# Altium project Multiplexor.PrjPcb
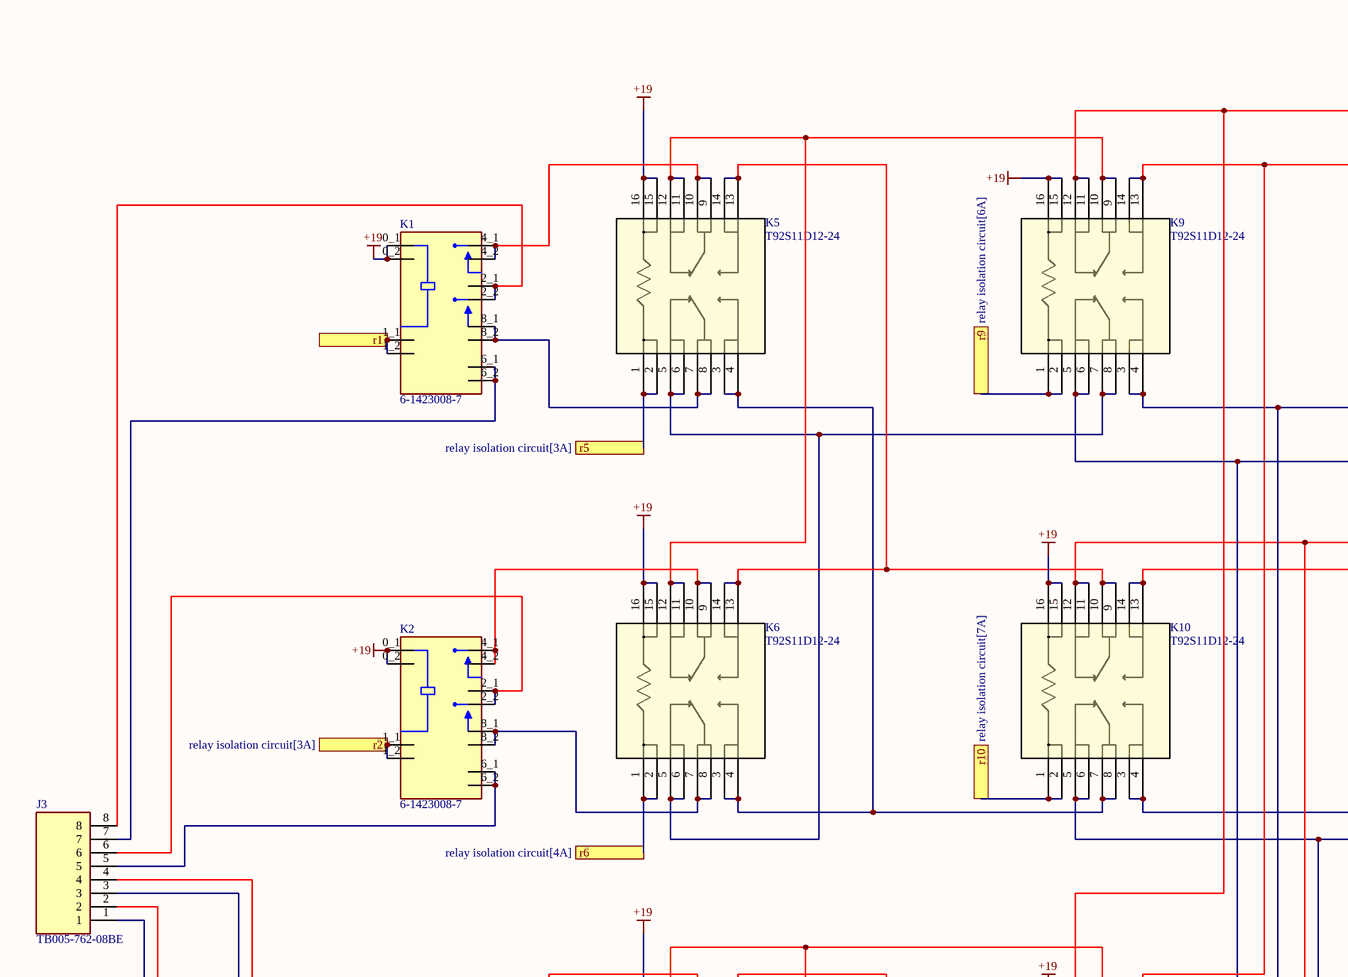
[diagram p0: multiplexor circuit.SchDoc, top left]
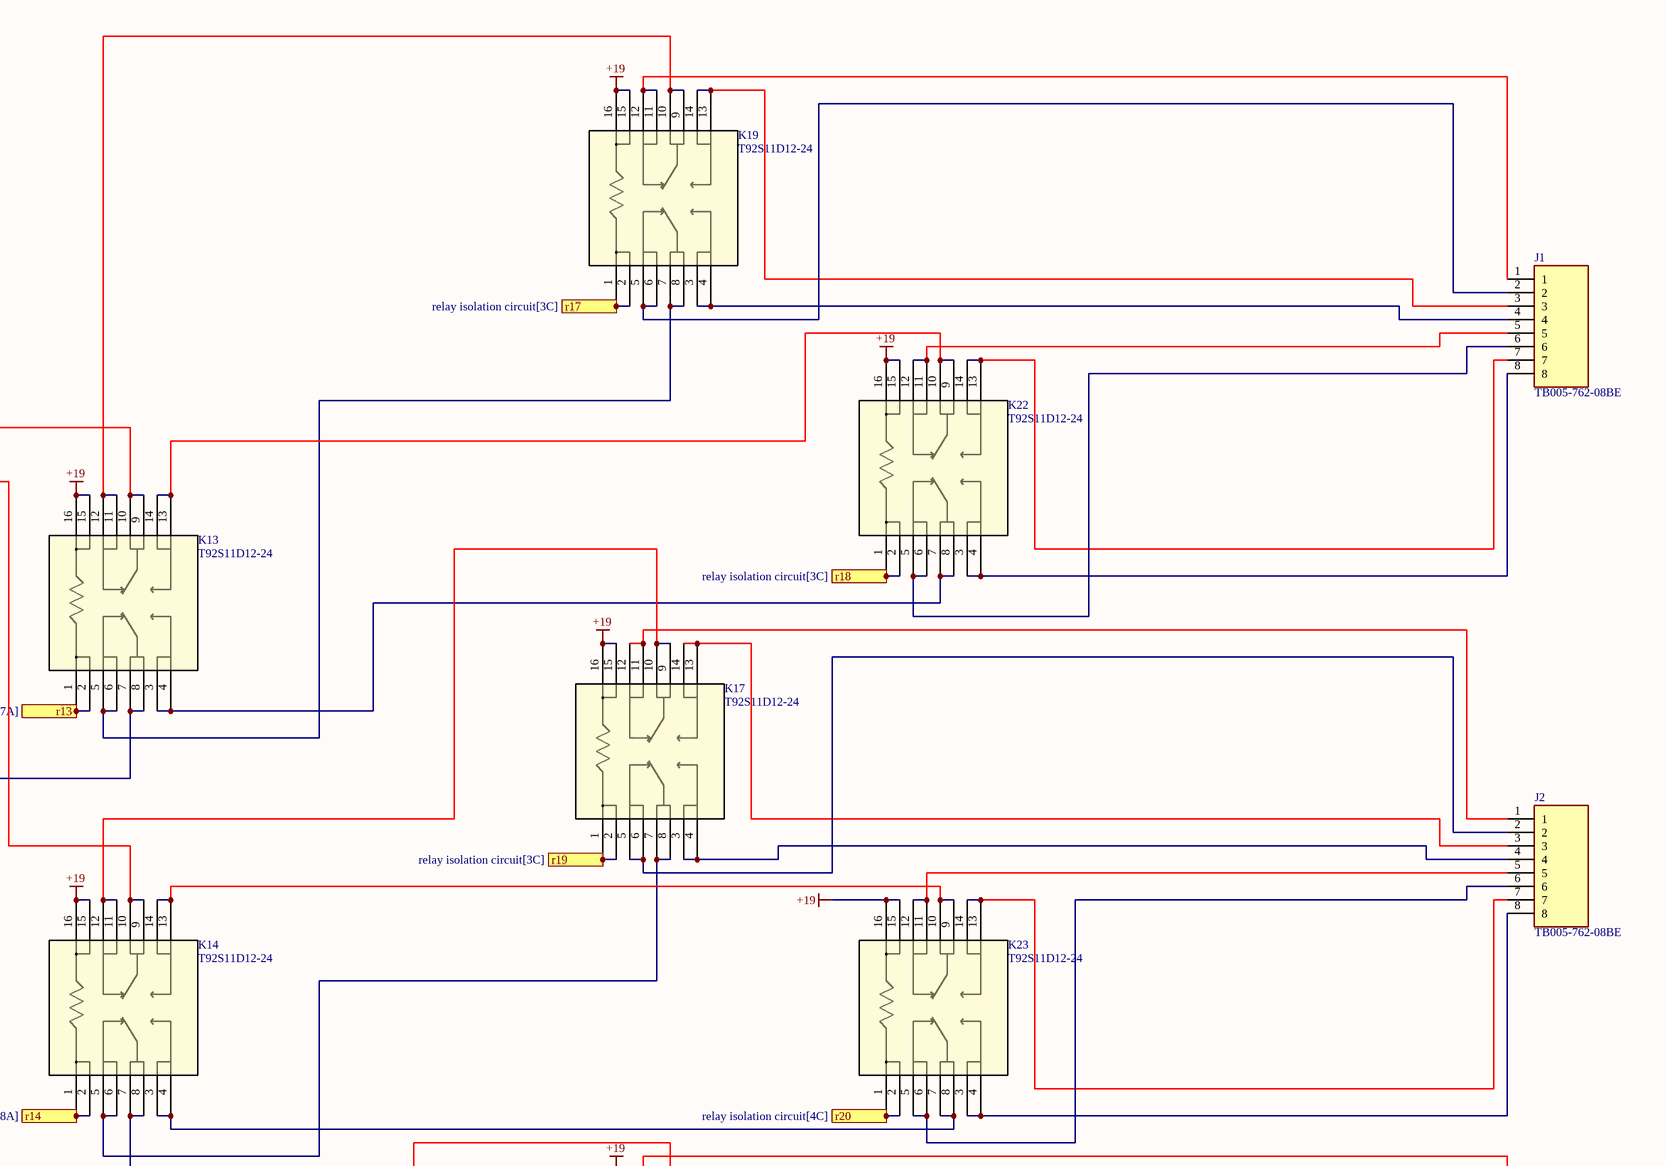
[diagram p1: multiplexor circuit.SchDoc, top right]
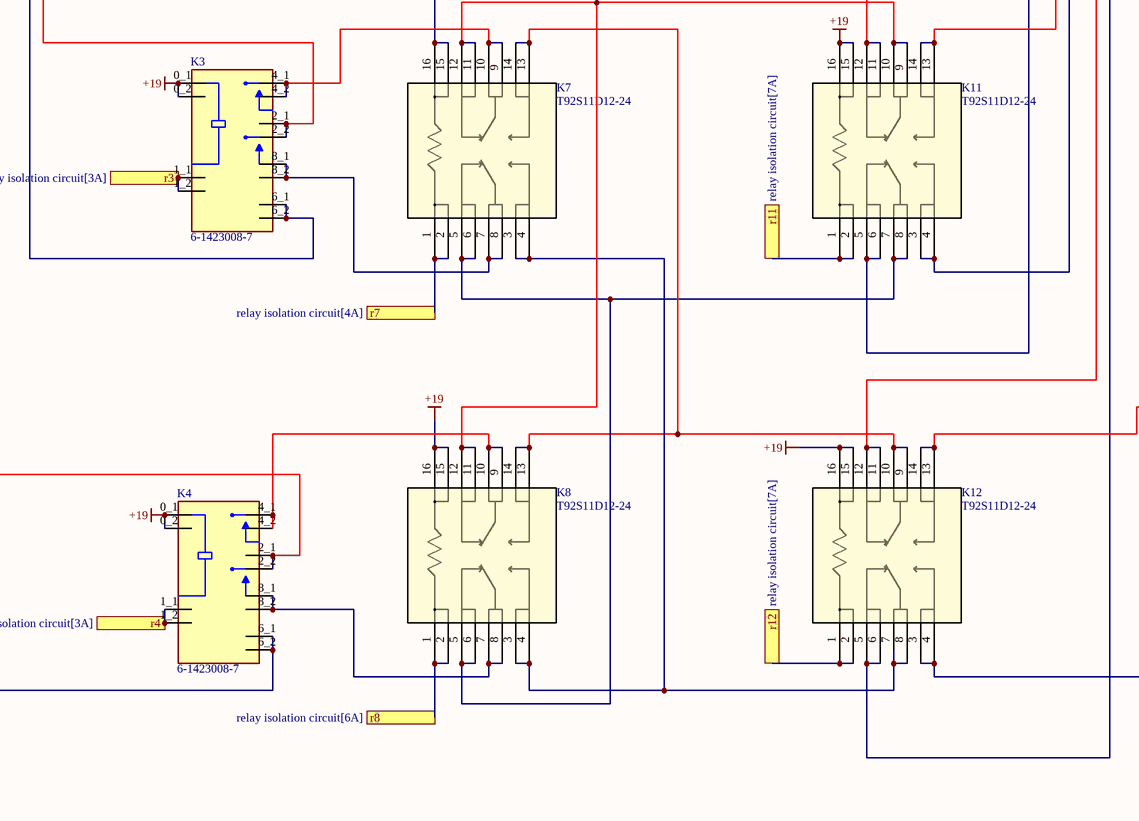
[diagram p2: multiplexor circuit.SchDoc, bottom left]
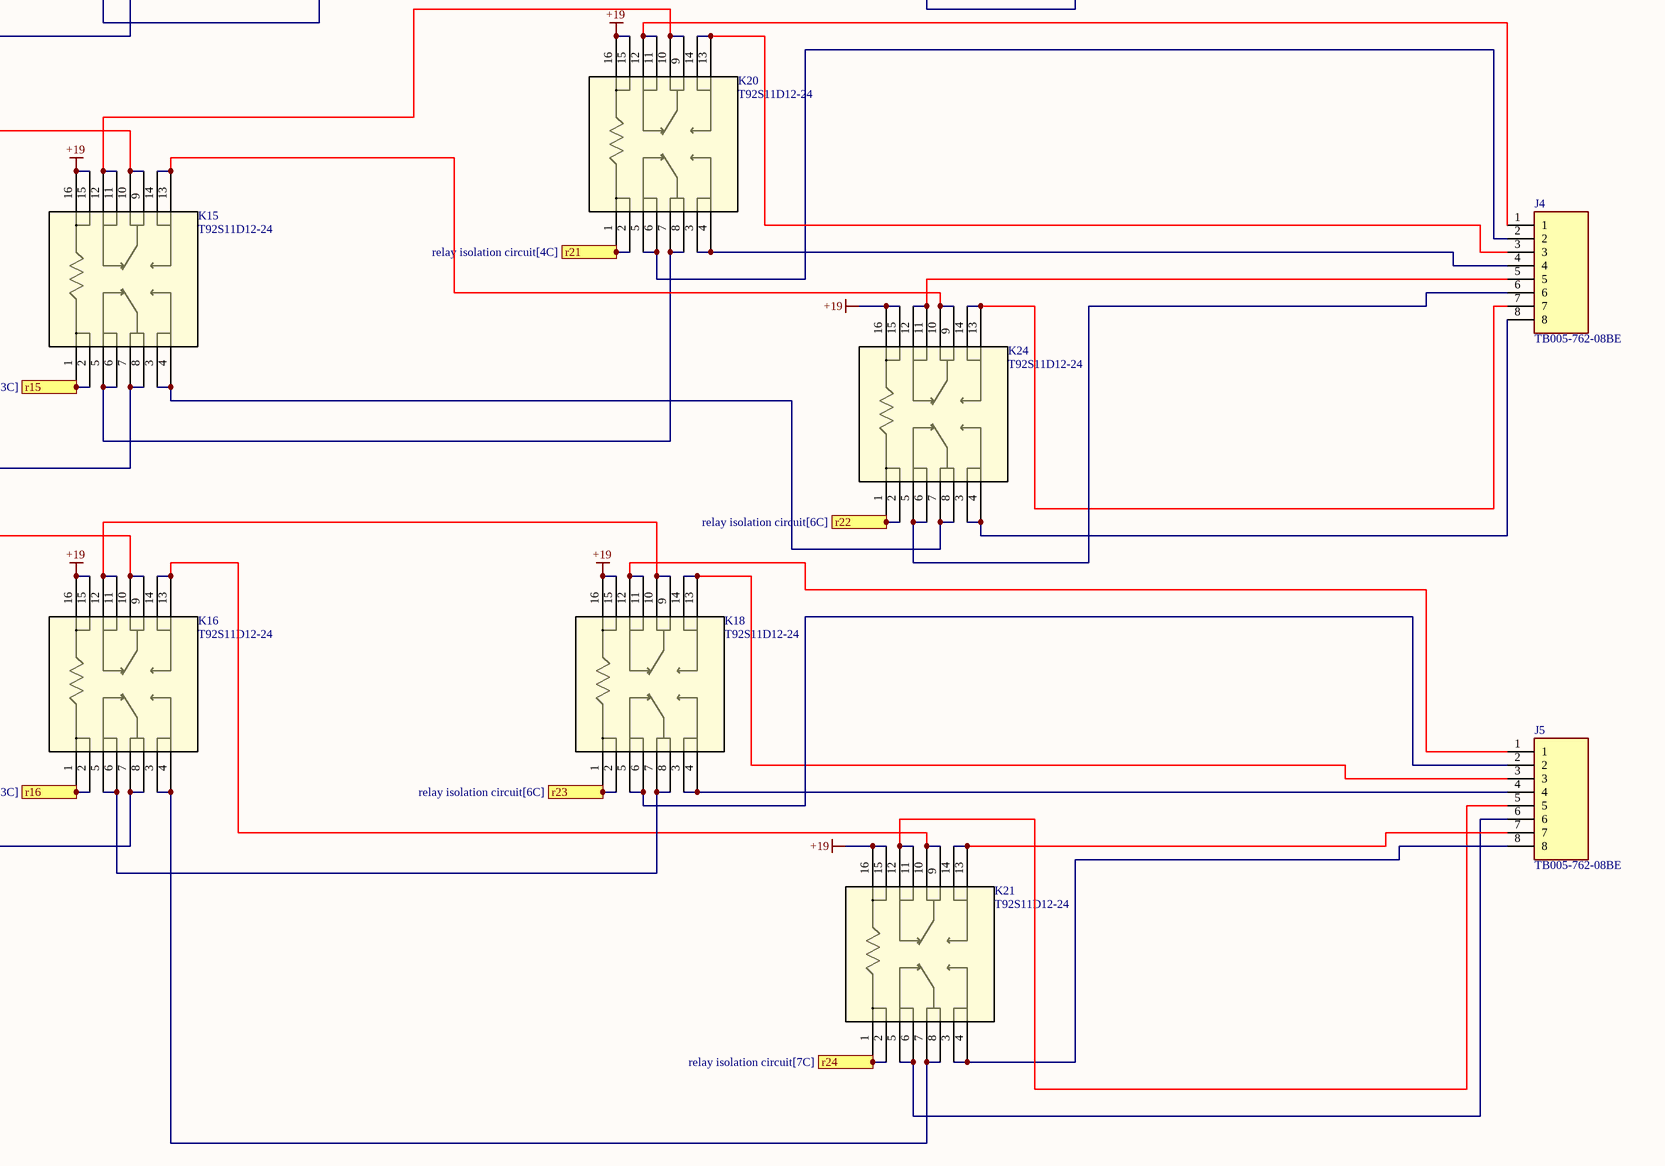
[diagram p3: multiplexor circuit.SchDoc, bottom right]
3 sheets, 181 parts. Net scope: flat (ports and power ports of the same name join across sheets).
Board file: multiplexor.PcbDoc
Sheets:
  multiplexor circuit.SchDoc
  relay isolation circuit.SchDoc
  Relay I2C to GPIO.SchDoc

## Sheet multiplexor circuit.SchDoc
size D; SheetNumber: 1; SheetTotal: 3

### Parts
J1  TB005-762-08BE  [CUI_TB005-762-08BE]
J2  TB005-762-08BE  [CUI_TB005-762-08BE]
J3  TB005-762-08BE  [CUI_TB005-762-08BE]
J4  TB005-762-08BE  [CUI_TB005-762-08BE]
J5  TB005-762-08BE  [CUI_TB005-762-08BE]
K1  6-1423008-7  [RELAY_6-1423008-7]
K2  6-1423008-7  [RELAY_6-1423008-7]
K3  6-1423008-7  [RELAY_6-1423008-7]
K4  6-1423008-7  [RELAY_6-1423008-7]
K5  T92S11D12-24  [T92S11D12-24_TEC-corrected]
K6  T92S11D12-24  [T92S11D12-24_TEC-corrected]
K7  T92S11D12-24  [T92S11D12-24_TEC-corrected]
K8  T92S11D12-24  [T92S11D12-24_TEC-corrected]
K9  T92S11D12-24  [T92S11D12-24_TEC-corrected]
K10  T92S11D12-24  [T92S11D12-24_TEC-corrected]
K11  T92S11D12-24  [T92S11D12-24_TEC-corrected]
K12  T92S11D12-24  [T92S11D12-24_TEC-corrected]
K13  T92S11D12-24  [T92S11D12-24_TEC-corrected]
K14  T92S11D12-24  [T92S11D12-24_TEC-corrected]
K15  T92S11D12-24  [T92S11D12-24_TEC-corrected]
K16  T92S11D12-24  [T92S11D12-24_TEC-corrected]
K17  T92S11D12-24  [T92S11D12-24_TEC-corrected]
K18  T92S11D12-24  [T92S11D12-24_TEC-corrected]
K19  T92S11D12-24  [T92S11D12-24_TEC-corrected]
K20  T92S11D12-24  [T92S11D12-24_TEC-corrected]
K21  T92S11D12-24  [T92S11D12-24_TEC-corrected]
K22  T92S11D12-24  [T92S11D12-24_TEC-corrected]
K23  T92S11D12-24  [T92S11D12-24_TEC-corrected]
K24  T92S11D12-24  [T92S11D12-24_TEC-corrected]

### Ports
r1 (see relay isolation circuit[3A]), r2 (see relay isolation circuit[3A]), r3 (see relay isolation circuit[3A]), r4 (see relay isolation circuit[3A]), r5 (see relay isolation circuit[3A]), r6 (see relay isolation circuit[4A]), r7 (see relay isolation circuit[4A]), r8 (see relay isolation circuit[6A]), r9 (see relay isolation circuit[6A]), r10 (see relay isolation circuit[7A]), r11 (see relay isolation circuit[7A]), r12 (see relay isolation circuit[7A]), r13 (see relay isolation circuit[7A]), r14 (see relay isolation circuit[8A]), r15 (see relay isolation circuit[3C]), r16 (see relay isolation circuit[3C]), r17 (see relay isolation circuit[3C]), r18 (see relay isolation circuit[3C]), r19 (see relay isolation circuit[3C]), r20 (see relay isolation circuit[4C]), r21 (see relay isolation circuit[4C]), r22 (see relay isolation circuit[6C]), r23 (see relay isolation circuit[6C]), r24 (see relay isolation circuit[7C])

### Nets
+19: K1.0_1(COIL1) K1.0_2(COIL1) K2.0_1(COIL1) K2.0_2(COIL1) K3.0_1(COIL1) K3.0_2(COIL1) K4.0_1(COIL1) K4.0_2(COIL1) K5.15 K5.16 K6.15 K6.16 K7.15 K7.16 K8.15 K8.16 K9.15 K9.16 K10.15 K10.16 K11.15 K11.16 K12.15 K12.16 K13.15 K13.16 K14.15 K14.16 K15.15 K15.16 K16.15 K16.16 K17.15 K17.16 K18.15 K18.16 K19.15 K19.16 K20.15 K20.16 K21.15 K21.16 K22.15 K22.16 K23.15 K23.16 K24.15 K24.16
NetCR1_2: K1.1_1(COIL2) K1.1_2(COIL2) ; port r1
NetCR2_2: K2.1_1(COIL2) K2.1_2(COIL2) ; port r2
NetCR3_2: K3.1_1(COIL2) K3.1_2(COIL2) ; port r3
NetCR4_2: K4.1_1(COIL2) K4.1_2(COIL2) ; port r4
NetCR5_2: K5.1 K5.2 ; port r5
NetCR6_2: K6.1 K6.2 ; port r6
NetCR7_2: K7.1 K7.2 ; port r7
NetCR8_2: K8.1 K8.2 ; port r8
NetCR9_2: K9.1 K9.2 ; port r9
NetCR10_2: K10.1 K10.2 ; port r10
NetCR11_2: K11.1 K11.2 ; port r11
NetCR12_2: K12.1 K12.2 ; port r12
NetCR13_2: K13.1 K13.2 ; port r13
NetCR14_2: K14.1 K14.2 ; port r14
NetCR15_2: K15.1 K15.2 ; port r15
NetCR16_2: K16.1 K16.2 ; port r16
NetCR17_2: K19.1 K19.2 ; port r17
NetCR18_2: K22.1 K22.2 ; port r18
NetCR19_2: K17.1 K17.2 ; port r19
NetCR20_2: K23.1 K23.2 ; port r20
NetCR21_2: K20.1 K20.2 ; port r21
NetCR22_2: K24.1 K24.2 ; port r22
NetCR23_2: K18.1 K18.2 ; port r23
NetCR24_2: K21.1 K21.2 ; port r24
NetJ1_1: J1.1 K19.11 K19.12
NetJ1_2: J1.2 K19.5 K19.6
NetJ1_3: J1.3 K19.13 K19.14
NetJ1_4: J1.4 K19.3 K19.4
NetJ1_5: J1.5 K22.11 K22.12
NetJ1_6: J1.6 K22.5 K22.6
NetJ1_7: J1.7 K22.13 K22.14
NetJ1_8: J1.8 K22.3 K22.4
NetJ2_1: J2.1 K17.11 K17.12
NetJ2_2: J2.2 K17.5 K17.6
NetJ2_3: J2.3 K17.13 K17.14
NetJ2_4: J2.4 K17.3 K17.4
NetJ2_5: J2.5 K23.11 K23.12
NetJ2_6: J2.6 K23.5 K23.6
NetJ2_7: J2.7 K23.13 K23.14
NetJ2_8: J2.8 K23.3 K23.4
NetJ3_1: J3.1 K4.6_1(NO2) K4.6_2(NO2)
NetJ3_2: J3.2 K4.2_1(NO1) K4.2_2(NO1)
NetJ3_3: J3.3 K3.6_1(NO2) K3.6_2(NO2)
NetJ3_4: J3.4 K3.2_1(NO1) K3.2_2(NO1)
NetJ3_5: J3.5 K2.6_1(NO2) K2.6_2(NO2)
NetJ3_6: J3.6 K2.2_1(NO1) K2.2_2(NO1)
NetJ3_7: J3.7 K1.6_1(NO2) K1.6_2(NO2)
NetJ3_8: J3.8 K1.2_1(NO1) K1.2_2(NO1)
NetJ4_1: J4.1 K20.11 K20.12
NetJ4_2: J4.2 K20.5 K20.6
NetJ4_3: J4.3 K20.13 K20.14
NetJ4_4: J4.4 K20.3 K20.4
NetJ4_5: J4.5 K24.11 K24.12
NetJ4_6: J4.6 K24.5 K24.6
NetJ4_7: J4.7 K24.13 K24.14
NetJ4_8: J4.8 K24.3 K24.4
NetJ5_1: J5.1 K18.11 K18.12
NetJ5_2: J5.2 K18.5 K18.6
NetJ5_3: J5.3 K18.13 K18.14
NetJ5_4: J5.4 K18.3 K18.4
NetJ5_5: J5.5 K21.11 K21.12
NetJ5_6: J5.6 K21.5 K21.6
NetJ5_7: J5.7 K21.13 K21.14
NetJ5_8: J5.8 K21.3 K21.4
NetK1_4_1: K1.4_1(COM1) K1.4_2(COM1) K5.9 K5.10
NetK1_8_1: K1.8_1(COM2) K1.8_2(COM2) K5.7 K5.8
NetK2_4_1: K2.4_1(COM1) K2.4_2(COM1) K6.9 K6.10
NetK2_8_1: K2.8_1(COM2) K2.8_2(COM2) K6.7 K6.8
NetK3_4_1: K3.4_1(COM1) K3.4_2(COM1) K7.9 K7.10
NetK3_8_1: K3.8_1(COM2) K3.8_2(COM2) K7.7 K7.8
NetK4_4_1: K4.4_1(COM1) K4.4_2(COM1) K8.9 K8.10
NetK4_8_1: K4.8_1(COM2) K4.8_2(COM2) K8.7 K8.8
NetK5_3: K5.3 K5.4 K6.3 K6.4 K10.7 K10.8
NetK5_5: K5.5 K5.6 K6.5 K6.6 K9.7 K9.8
NetK5_11: K5.11 K5.12 K6.11 K6.12 K9.9 K9.10
NetK5_13: K5.13 K5.14 K6.13 K6.14 K10.9 K10.10
NetK7_3: K7.3 K7.4 K8.3 K8.4 K12.7 K12.8
NetK7_5: K7.5 K7.6 K8.5 K8.6 K11.7 K11.8
NetK7_11: K7.11 K7.12 K8.11 K8.12 K11.9 K11.10
NetK7_13: K7.13 K7.14 K8.13 K8.14 K12.9 K12.10
NetK9_3: K9.3 K9.4 K11.3 K11.4 K14.7 K14.8
NetK9_5: K9.5 K9.6 K11.5 K11.6 K13.7 K13.8
NetK9_11: K9.11 K9.12 K11.11 K11.12 K13.9 K13.10
NetK9_13: K9.13 K9.14 K11.13 K11.14 K14.9 K14.10
NetK10_3: K10.3 K10.4 K12.3 K12.4 K16.7 K16.8
NetK10_5: K10.5 K10.6 K12.5 K12.6 K15.7 K15.8
NetK10_11: K10.11 K10.12 K12.11 K12.12 K15.9 K15.10
NetK10_13: K10.13 K10.14 K12.13 K12.14 K16.9 K16.10
NetK13_3: K13.3 K13.4 K22.7 K22.8
NetK13_5: K13.5 K13.6 K19.7 K19.8
NetK13_11: K13.11 K13.12 K19.9 K19.10
NetK13_13: K13.13 K13.14 K22.9 K22.10
NetK14_3: K14.3 K14.4 K23.7 K23.8
NetK14_5: K14.5 K14.6 K17.7 K17.8
NetK14_11: K14.11 K14.12 K17.9 K17.10
NetK14_13: K14.13 K14.14 K23.9 K23.10
NetK15_3: K15.3 K15.4 K24.7 K24.8
NetK15_5: K15.5 K15.6 K20.7 K20.8
NetK15_11: K15.11 K15.12 K20.9 K20.10
NetK15_13: K15.13 K15.14 K24.9 K24.10
NetK16_3: K16.3 K16.4 K21.7 K21.8
NetK16_5: K16.5 K16.6 K18.7 K18.8
NetK16_11: K16.11 K16.12 K18.9 K18.10
NetK16_13: K16.13 K16.14 K21.9 K21.10

### Library data of the parts
K1-K4 = 6-1423008-7: General Purpose Relay DPST-NO (2 Form A) 24VDC Coil Through Hole; MF: TE Connectivity / P&B; MP: 6-1423008-7; Package: None; Purchase-URL: https://pricing.snapeda.com/search/part/6-1423008-7/?ref=eda; Price: None; Value: *; SnapEDA_Link: https://www.snapeda.com/parts/6-1423008-7/TE%20Connectivity/view-part/6301405/?ref=snap; Check_prices: https://www.snapeda.com/parts/6-1423008-7/TE%20Connectivity/view-part/6301405/?ref=eda; Availability: In Stock
K5-K24 = T92S11D12-24: No Description Available; Mfr_Name: TE Connectivity; Copyright: Copyright (C) 2022 Ultra Librarian. All rights reserved.; Manufacturer_Part_Number: T92S11D12-24; Digi-Key_Part_Number_1: PB352-ND; RefDes: RefDes; Type: DEV
J1-J5 = TB005-762-08BE: Package: None; Price: None; Value: *; MP: TB005-762-08BE; Availability: Unavailable

## Sheet relay isolation circuit.SchDoc
size D; SheetNumber: 2; SheetTotal: 3; SPICEModelCachePQJRNVQB: <root> / <DocumentId>PQJRNVQB</DocumentId> / </root>
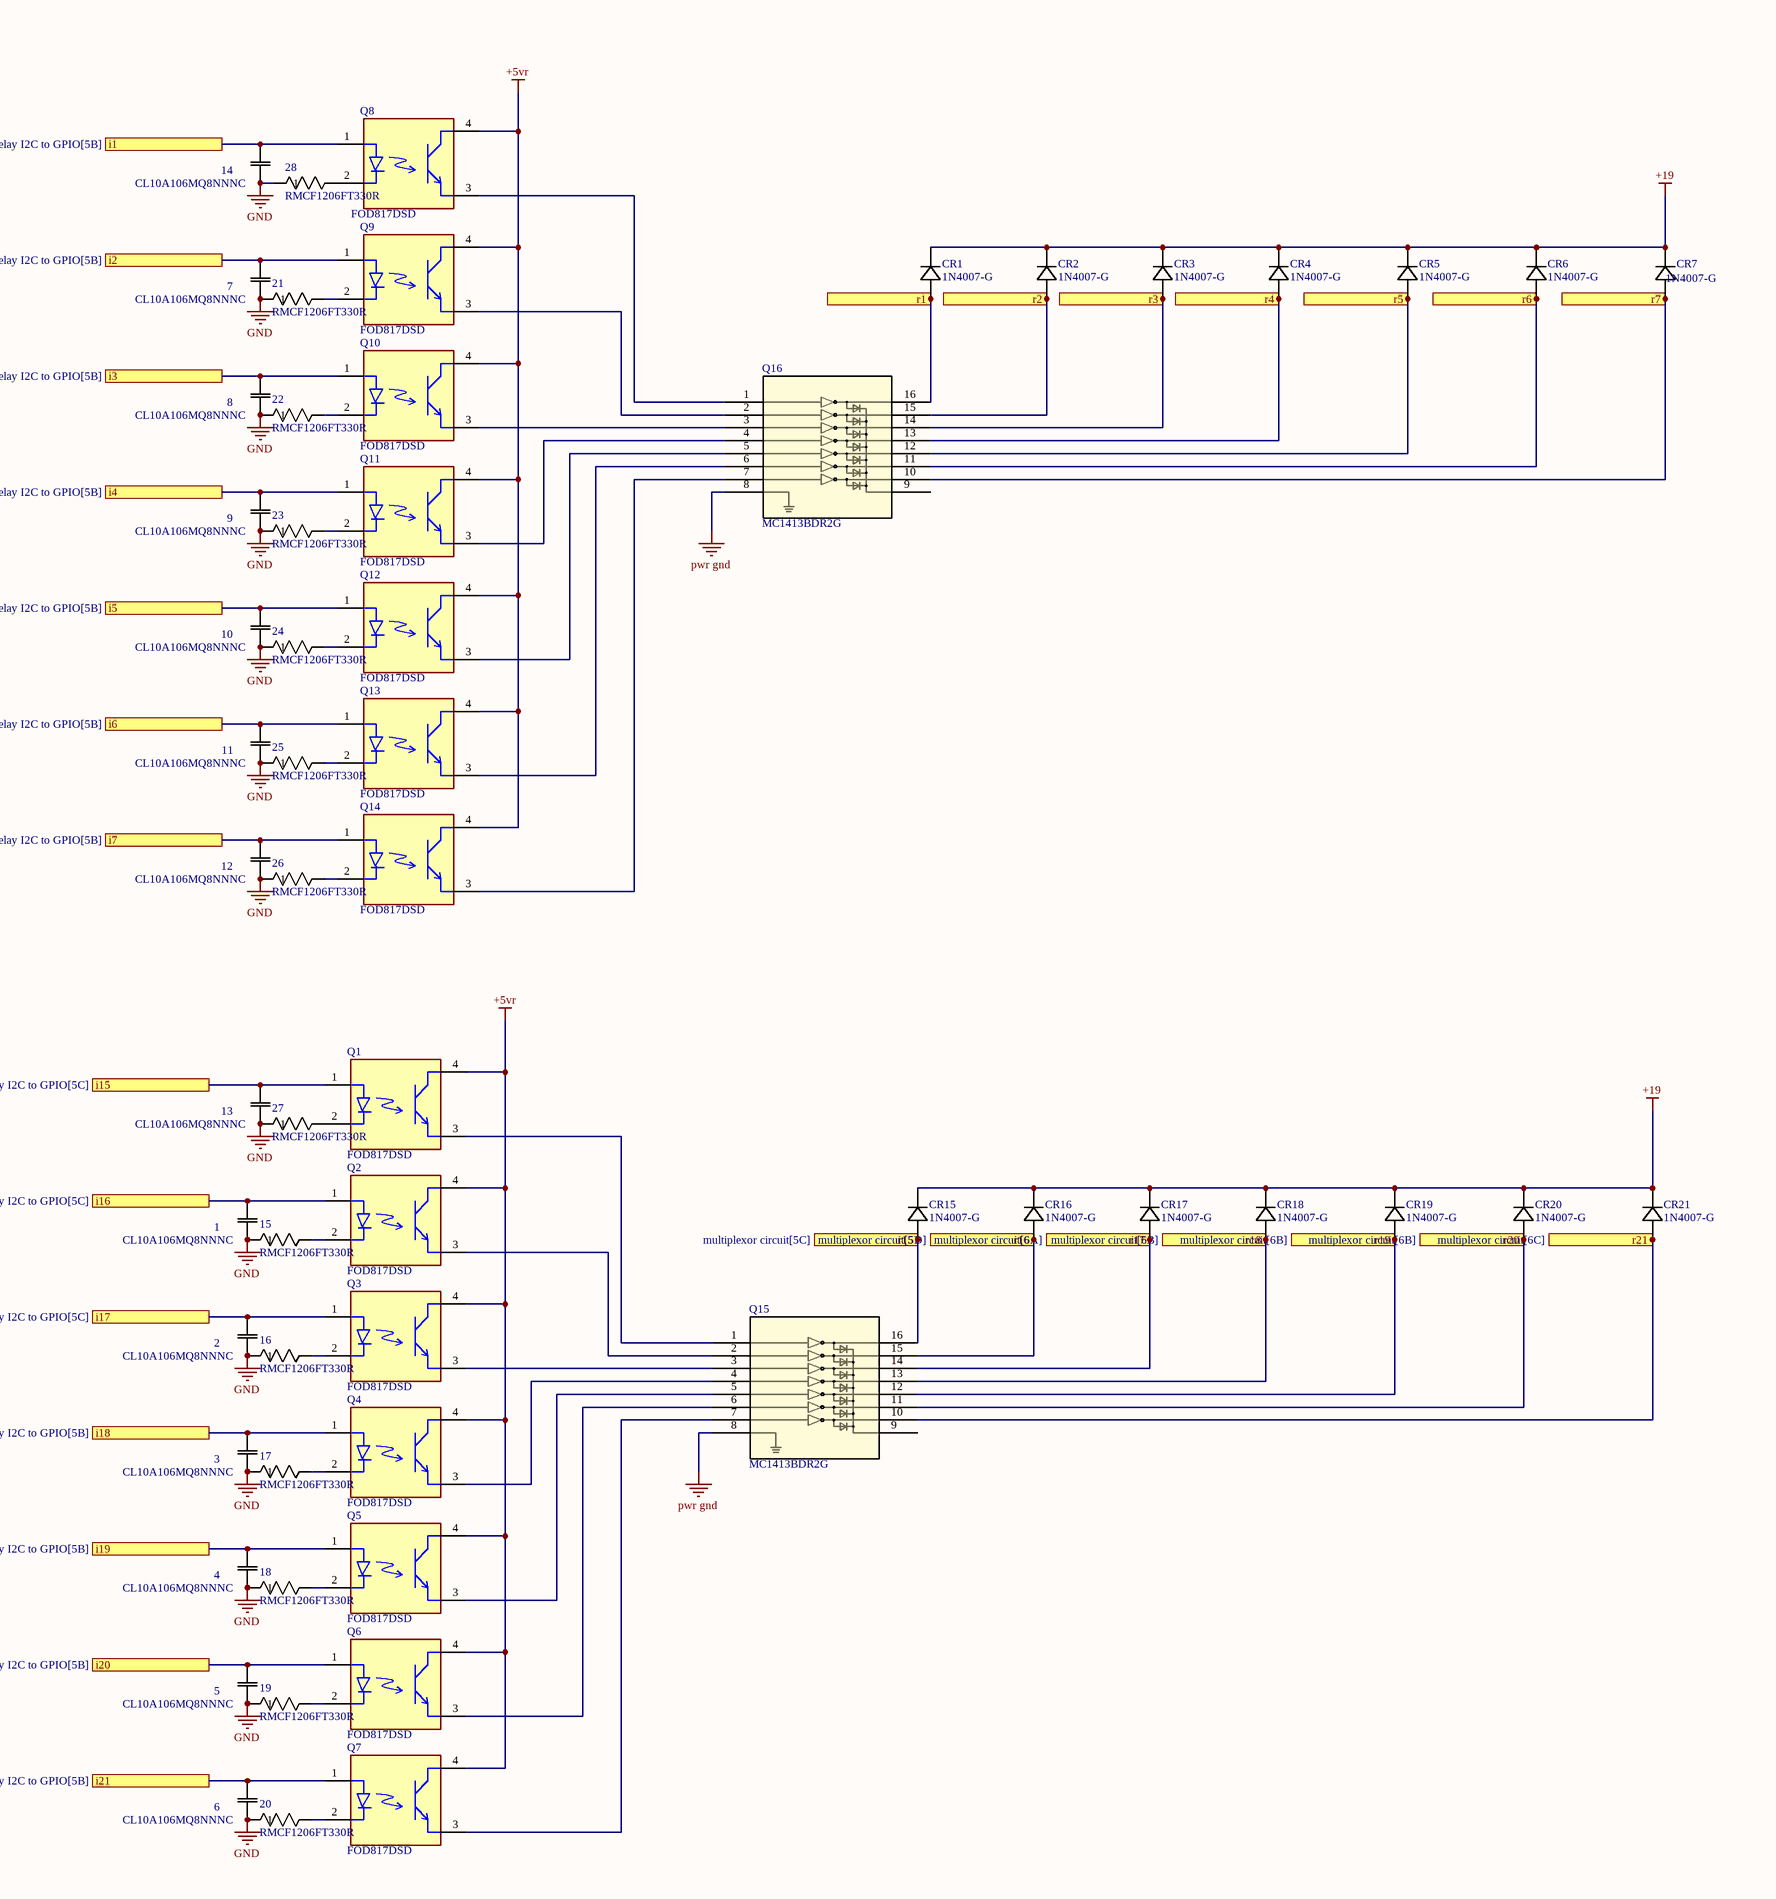
[diagram p4: relay isolation circuit.SchDoc, left]
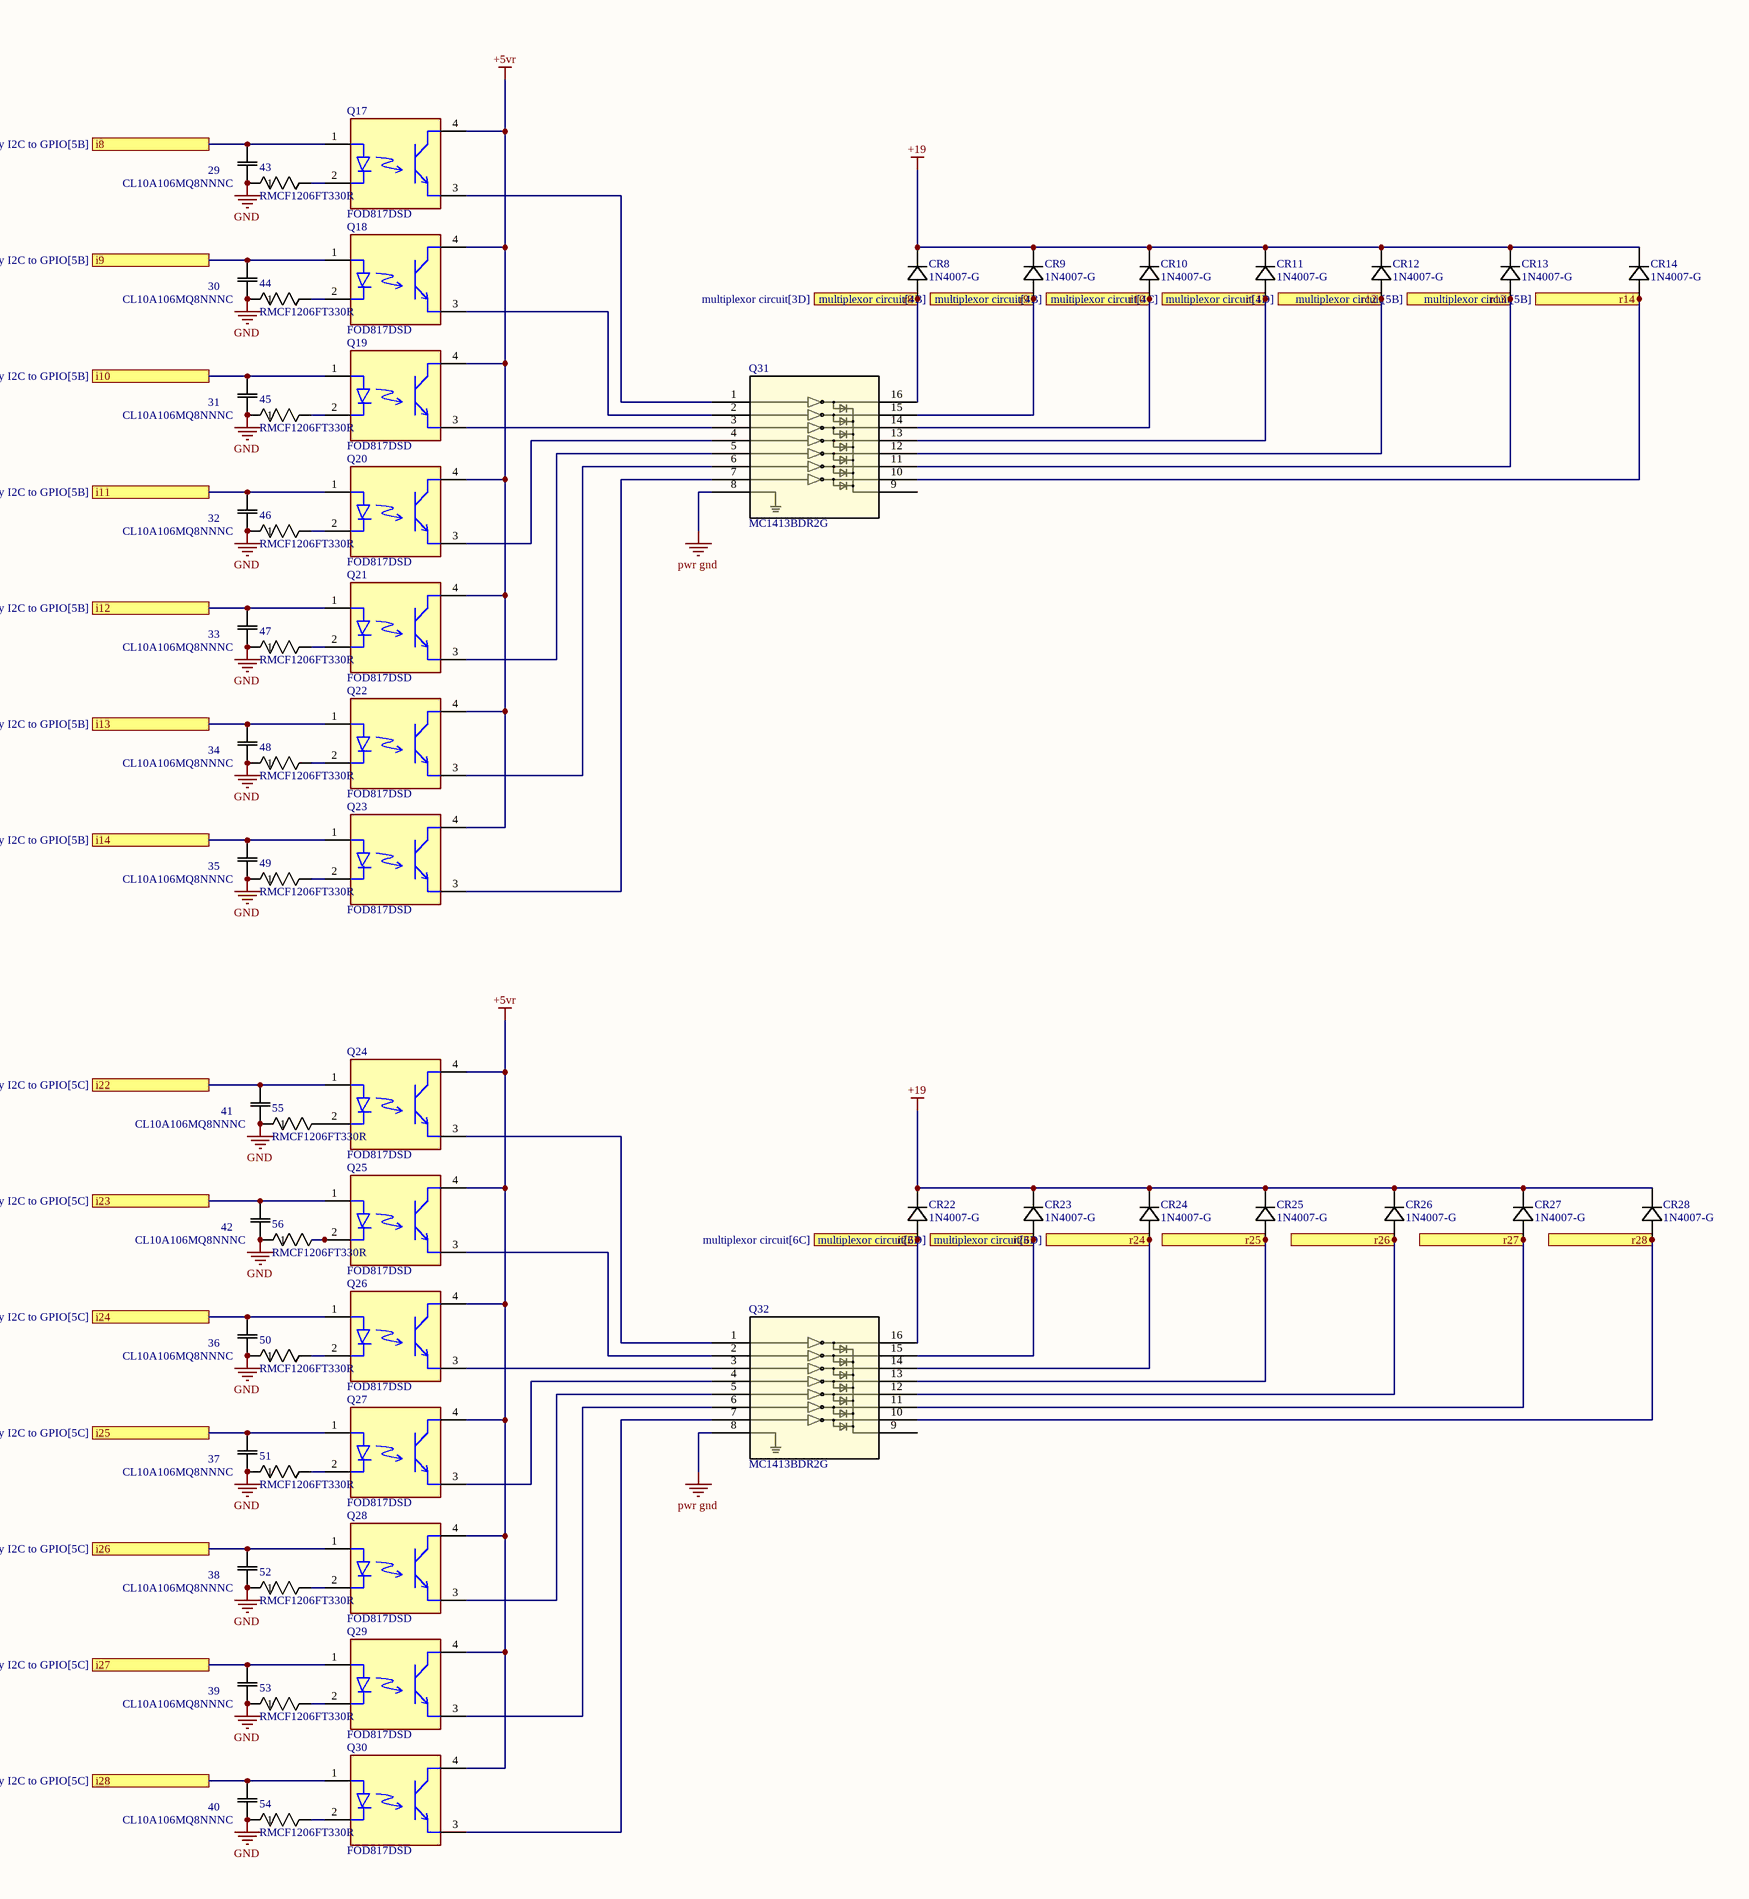
[diagram p5: relay isolation circuit.SchDoc, right]

### Parts
1  CL10A106MQ8NNNC  [CAP_CL10_SAM]
2  CL10A106MQ8NNNC  [CAP_CL10_SAM]
3  CL10A106MQ8NNNC  [CAP_CL10_SAM]
4  CL10A106MQ8NNNC  [CAP_CL10_SAM]
5  CL10A106MQ8NNNC  [CAP_CL10_SAM]
6  CL10A106MQ8NNNC  [CAP_CL10_SAM]
7  CL10A106MQ8NNNC  [CAP_CL10_SAM]
8  CL10A106MQ8NNNC  [CAP_CL10_SAM]
9  CL10A106MQ8NNNC  [CAP_CL10_SAM]
10  CL10A106MQ8NNNC  [CAP_CL10_SAM]
11  CL10A106MQ8NNNC  [CAP_CL10_SAM]
12  CL10A106MQ8NNNC  [CAP_CL10_SAM]
13  CL10A106MQ8NNNC  [CAP_CL10_SAM]
14  CL10A106MQ8NNNC  [CAP_CL10_SAM]
15  RMCF1206FT330R  [STA_RMCF1206_STP]
16  RMCF1206FT330R  [STA_RMCF1206_STP]
17  RMCF1206FT330R  [STA_RMCF1206_STP]
18  RMCF1206FT330R  [STA_RMCF1206_STP]
19  RMCF1206FT330R  [STA_RMCF1206_STP]
20  RMCF1206FT330R  [STA_RMCF1206_STP]
21  RMCF1206FT330R  [STA_RMCF1206_STP]
22  RMCF1206FT330R  [STA_RMCF1206_STP]
23  RMCF1206FT330R  [STA_RMCF1206_STP]
24  RMCF1206FT330R  [STA_RMCF1206_STP]
25  RMCF1206FT330R  [STA_RMCF1206_STP]
26  RMCF1206FT330R  [STA_RMCF1206_STP]
27  RMCF1206FT330R  [STA_RMCF1206_STP]
28  RMCF1206FT330R  [STA_RMCF1206_STP]
29  CL10A106MQ8NNNC  [CAP_CL10_SAM]
30  CL10A106MQ8NNNC  [CAP_CL10_SAM]
31  CL10A106MQ8NNNC  [CAP_CL10_SAM]
32  CL10A106MQ8NNNC  [CAP_CL10_SAM]
33  CL10A106MQ8NNNC  [CAP_CL10_SAM]
34  CL10A106MQ8NNNC  [CAP_CL10_SAM]
35  CL10A106MQ8NNNC  [CAP_CL10_SAM]
36  CL10A106MQ8NNNC  [CAP_CL10_SAM]
37  CL10A106MQ8NNNC  [CAP_CL10_SAM]
38  CL10A106MQ8NNNC  [CAP_CL10_SAM]
39  CL10A106MQ8NNNC  [CAP_CL10_SAM]
40  CL10A106MQ8NNNC  [CAP_CL10_SAM]
41  CL10A106MQ8NNNC  [CAP_CL10_SAM]
42  CL10A106MQ8NNNC  [CAP_CL10_SAM]
43  RMCF1206FT330R  [STA_RMCF1206_STP]
44  RMCF1206FT330R  [STA_RMCF1206_STP]
45  RMCF1206FT330R  [STA_RMCF1206_STP]
46  RMCF1206FT330R  [STA_RMCF1206_STP]
47  RMCF1206FT330R  [STA_RMCF1206_STP]
48  RMCF1206FT330R  [STA_RMCF1206_STP]
49  RMCF1206FT330R  [STA_RMCF1206_STP]
50  RMCF1206FT330R  [STA_RMCF1206_STP]
51  RMCF1206FT330R  [STA_RMCF1206_STP]
52  RMCF1206FT330R  [STA_RMCF1206_STP]
53  RMCF1206FT330R  [STA_RMCF1206_STP]
54  RMCF1206FT330R  [STA_RMCF1206_STP]
55  RMCF1206FT330R  [STA_RMCF1206_STP]
56  RMCF1206FT330R  [STA_RMCF1206_STP]
CR1  1N4007-G  [1N4-G]
CR2  1N4007-G  [1N4-G]
CR3  1N4007-G  [1N4-G]
CR4  1N4007-G  [1N4-G]
CR5  1N4007-G  [1N4-G]
CR6  1N4007-G  [1N4-G]
CR7  1N4007-G  [1N4-G]
CR8  1N4007-G  [1N4-G]
CR9  1N4007-G  [1N4-G]
CR10  1N4007-G  [1N4-G]
CR11  1N4007-G  [1N4-G]
CR12  1N4007-G  [1N4-G]
CR13  1N4007-G  [1N4-G]
CR14  1N4007-G  [1N4-G]
CR15  1N4007-G  [1N4-G]
CR16  1N4007-G  [1N4-G]
CR17  1N4007-G  [1N4-G]
CR18  1N4007-G  [1N4-G]
CR19  1N4007-G  [1N4-G]
CR20  1N4007-G  [1N4-G]
CR21  1N4007-G  [1N4-G]
CR22  1N4007-G  [1N4-G]
CR23  1N4007-G  [1N4-G]
CR24  1N4007-G  [1N4-G]
CR25  1N4007-G  [1N4-G]
CR26  1N4007-G  [1N4-G]
CR27  1N4007-G  [1N4-G]
CR28  1N4007-G  [1N4-G]
Q1  FOD817DSD  [FP-709AH-MFG]
Q2  FOD817DSD  [FP-709AH-MFG]
Q3  FOD817DSD  [FP-709AH-MFG]
Q4  FOD817DSD  [FP-709AH-MFG]
Q5  FOD817DSD  [FP-709AH-MFG]
Q6  FOD817DSD  [FP-709AH-MFG]
Q7  FOD817DSD  [FP-709AH-MFG]
Q8  FOD817DSD  [FP-709AH-MFG]
Q9  FOD817DSD  [FP-709AH-MFG]
Q10  FOD817DSD  [FP-709AH-MFG]
Q11  FOD817DSD  [FP-709AH-MFG]
Q12  FOD817DSD  [FP-709AH-MFG]
Q13  FOD817DSD  [FP-709AH-MFG]
Q14  FOD817DSD  [FP-709AH-MFG]
Q15  MC1413BDR2G  [SOIC16_751B-05_ONS]
Q16  MC1413BDR2G  [SOIC16_751B-05_ONS]
Q17  FOD817DSD  [FP-709AH-MFG]
Q18  FOD817DSD  [FP-709AH-MFG]
Q19  FOD817DSD  [FP-709AH-MFG]
Q20  FOD817DSD  [FP-709AH-MFG]
Q21  FOD817DSD  [FP-709AH-MFG]
Q22  FOD817DSD  [FP-709AH-MFG]
Q23  FOD817DSD  [FP-709AH-MFG]
Q24  FOD817DSD  [FP-709AH-MFG]
Q25  FOD817DSD  [FP-709AH-MFG]
Q26  FOD817DSD  [FP-709AH-MFG]
Q27  FOD817DSD  [FP-709AH-MFG]
Q28  FOD817DSD  [FP-709AH-MFG]
Q29  FOD817DSD  [FP-709AH-MFG]
Q30  FOD817DSD  [FP-709AH-MFG]
Q31  MC1413BDR2G  [SOIC16_751B-05_ONS]
Q32  MC1413BDR2G  [SOIC16_751B-05_ONS]

### Ports
i1 (see Relay I2C to GPIO[5B]), i2 (see Relay I2C to GPIO[5B]), i3 (see Relay I2C to GPIO[5B]), i4 (see Relay I2C to GPIO[5B]), i5 (see Relay I2C to GPIO[5B]), i6 (see Relay I2C to GPIO[5B]), i7 (see Relay I2C to GPIO[5B]), i8 (see Relay I2C to GPIO[5B]), i9 (see Relay I2C to GPIO[5B]), i10 (see Relay I2C to GPIO[5B]), i11 (see Relay I2C to GPIO[5B]), i12 (see Relay I2C to GPIO[5B]), i13 (see Relay I2C to GPIO[5B]), i14 (see Relay I2C to GPIO[5B]), i15 (see Relay I2C to GPIO[5C]), i16 (see Relay I2C to GPIO[5C]), i17 (see Relay I2C to GPIO[5C]), i18 (see Relay I2C to GPIO[5B]), i19 (see Relay I2C to GPIO[5B]), i20 (see Relay I2C to GPIO[5B]), i21 (see Relay I2C to GPIO[5B]), i22 (see Relay I2C to GPIO[5C]), i23 (see Relay I2C to GPIO[5C]), i24 (see Relay I2C to GPIO[5C]), i25 (see Relay I2C to GPIO[5C]), i26 (see Relay I2C to GPIO[5C]), i27 (see Relay I2C to GPIO[5C]), i28 (see Relay I2C to GPIO[5C]), r1 (see multiplexor circuit[3B]), r2 (see multiplexor circuit[3B]), r3 (see multiplexor circuit[3C]), r4 (see multiplexor circuit[3D]), r5 (see multiplexor circuit[3B]), r6 (see multiplexor circuit[3C]), r7 (see multiplexor circuit[3C]), r8 (see multiplexor circuit[3D]), r9 (see multiplexor circuit[4B]), r10 (see multiplexor circuit[4B]), r11 (see multiplexor circuit[4C]), r12 (see multiplexor circuit[4D]), r13 (see multiplexor circuit[5B]), r14 (see multiplexor circuit[5B]), r15 (see multiplexor circuit[5C]), r16 (see multiplexor circuit[5D]), r17 (see multiplexor circuit[6A]), r18 (see multiplexor circuit[6B]), r19 (see multiplexor circuit[6B]), r20 (see multiplexor circuit[6B]), r21 (see multiplexor circuit[6C]), r22 (see multiplexor circuit[6C]), r23 (see multiplexor circuit[6D]), r24 (see multiplexor circuit[6D]), r25, r26, r27, r28

### Nets
+5vr: Q1.4(C) Q2.4(C) Q3.4(C) Q4.4(C) Q5.4(C) Q6.4(C) Q7.4(C) Q8.4(C) Q9.4(C) Q10.4(C) Q11.4(C) Q12.4(C) Q13.4(C) Q14.4(C) Q17.4(C) Q18.4(C) Q19.4(C) Q20.4(C) Q21.4(C) Q22.4(C) Q23.4(C) Q24.4(C) Q25.4(C) Q26.4(C) Q27.4(C) Q28.4(C) Q29.4(C) Q30.4(C)
+19: CR1.1 CR2.1 CR3.1 CR4.1 CR5.1 CR6.1 CR7.1 CR8.1 CR9.1 CR10.1 CR11.1 CR12.1 CR13.1 CR14.1 CR15.1 CR16.1 CR17.1 CR18.1 CR19.1 CR20.1 CR21.1 CR22.1 CR23.1 CR24.1 CR25.1 CR26.1 CR27.1 CR28.1
GND: 1.1 2.1 3.1 4.1 5.1 6.1 7.1 8.1 9.1 10.1 11.1 12.1 13.1 14.1 15.1 16.1 17.1 18.1 19.1 20.1 21.1 22.1 23.1 24.1 25.1 26.1 27.1 28.1 29.1 30.1 31.1 32.1 33.1 34.1 35.1 36.1 37.1 38.1 39.1 40.1 41.1 42.1 43.1 44.1 45.1 46.1 47.1 48.1 49.1 50.1 51.1 52.1 53.1 54.1 55.1 56.1
pwr gnd: Q15.8 Q16.8 Q31.8 Q32.8
Net1_2: 1.2 Q2.1(A) ; port i16
Net2_2: 2.2 Q3.1(A) ; port i17
Net3_2: 3.2 Q4.1(A) ; port i18
Net4_2: 4.2 Q5.1(A) ; port i19
Net5_2: 5.2 Q6.1(A) ; port i20
Net6_2: 6.2 Q7.1(A) ; port i21
Net7_2: 7.2 Q9.1(A) ; port i2
Net8_2: 8.2 Q10.1(A) ; port i3
Net9_2: 9.2 Q11.1(A) ; port i4
Net10_2: 10.2 Q12.1(A) ; port i5
Net11_2: 11.2 Q13.1(A) ; port i6
Net12_2: 12.2 Q14.1(A) ; port i7
Net13_2: 13.2 Q1.1(A) ; port i15
Net14_2: 14.2 Q8.1(A) ; port i1
Net15_2: 15.2 Q2.2(C)
Net16_2: 16.2 Q3.2(C)
Net17_2: 17.2 Q4.2(C)
Net18_2: 18.2 Q5.2(C)
Net19_2: 19.2 Q6.2(C)
Net20_2: 20.2 Q7.2(C)
Net21_2: 21.2 Q9.2(C)
Net22_2: 22.2 Q10.2(C)
Net23_2: 23.2 Q11.2(C)
Net24_2: 24.2 Q12.2(C)
Net25_2: 25.2 Q13.2(C)
Net26_2: 26.2 Q14.2(C)
Net27_2: 27.2 Q1.2(C)
Net28_2: 28.2 Q8.2(C)
Net29_2: 29.2 Q17.1(A) ; port i8
Net30_2: 30.2 Q18.1(A) ; port i9
Net31_2: 31.2 Q19.1(A) ; port i10
Net32_2: 32.2 Q20.1(A) ; port i11
Net33_2: 33.2 Q21.1(A) ; port i12
Net34_2: 34.2 Q22.1(A) ; port i13
Net35_2: 35.2 Q23.1(A) ; port i14
Net36_2: 36.2 Q26.1(A) ; port i24
Net37_2: 37.2 Q27.1(A) ; port i25
Net38_2: 38.2 Q28.1(A) ; port i26
Net39_2: 39.2 Q29.1(A) ; port i27
Net40_2: 40.2 Q30.1(A) ; port i28
Net41_2: 41.2 Q24.1(A) ; port i22
Net42_2: 42.2 Q25.1(A) ; port i23
Net43_2: 43.2 Q17.2(C)
Net44_2: 44.2 Q18.2(C)
Net45_2: 45.2 Q19.2(C)
Net46_2: 46.2 Q20.2(C)
Net47_2: 47.2 Q21.2(C)
Net48_2: 48.2 Q22.2(C)
Net49_2: 49.2 Q23.2(C)
Net50_2: 50.2 Q26.2(C)
Net51_2: 51.2 Q27.2(C)
Net52_2: 52.2 Q28.2(C)
Net53_2: 53.2 Q29.2(C)
Net54_2: 54.2 Q30.2(C)
Net55_2: 55.2 Q24.2(C)
Net56_2: 56.2 Q25.2(C)
NetCR1_2: CR1.2 Q16.16 ; port r1
NetCR2_2: CR2.2 Q16.15 ; port r2
NetCR3_2: CR3.2 Q16.14 ; port r3
NetCR4_2: CR4.2 Q16.13 ; port r4
NetCR5_2: CR5.2 Q16.12 ; port r5
NetCR6_2: CR6.2 Q16.11 ; port r6
NetCR7_2: CR7.2 Q16.10 ; port r7
NetCR8_2: CR8.2 Q31.16 ; port r8
NetCR9_2: CR9.2 Q31.15 ; port r9
NetCR10_2: CR10.2 Q31.14 ; port r10
NetCR11_2: CR11.2 Q31.13 ; port r11
NetCR12_2: CR12.2 Q31.12 ; port r12
NetCR13_2: CR13.2 Q31.11 ; port r13
NetCR14_2: CR14.2 Q31.10 ; port r14
NetCR15_2: CR15.2 Q15.16 ; port r15
NetCR16_2: CR16.2 Q15.15 ; port r16
NetCR17_2: CR17.2 Q15.14 ; port r17
NetCR18_2: CR18.2 Q15.13 ; port r18
NetCR19_2: CR19.2 Q15.12 ; port r19
NetCR20_2: CR20.2 Q15.11 ; port r20
NetCR21_2: CR21.2 Q15.10 ; port r21
NetCR22_2: CR22.2 Q32.16 ; port r22
NetCR23_2: CR23.2 Q32.15 ; port r23
NetCR24_2: CR24.2 Q32.14 ; port r24
NetCR25_2: CR25.2 Q32.13 ; port r25
NetCR26_2: CR26.2 Q32.12 ; port r26
NetCR27_2: CR27.2 Q32.11 ; port r27
NetCR28_2: CR28.2 Q32.10 ; port r28
NetQ1_3: Q1.3(E) Q15.1
NetQ2_3: Q2.3(E) Q15.2
NetQ3_3: Q3.3(E) Q15.3
NetQ4_3: Q4.3(E) Q15.4
NetQ5_3: Q5.3(E) Q15.5
NetQ6_3: Q6.3(E) Q15.6
NetQ7_3: Q7.3(E) Q15.7
NetQ8_3: Q8.3(E) Q16.1
NetQ9_3: Q9.3(E) Q16.2
NetQ10_3: Q10.3(E) Q16.3
NetQ11_3: Q11.3(E) Q16.4
NetQ12_3: Q12.3(E) Q16.5
NetQ13_3: Q13.3(E) Q16.6
NetQ14_3: Q14.3(E) Q16.7
NetQ17_3: Q17.3(E) Q31.1
NetQ18_3: Q18.3(E) Q31.2
NetQ19_3: Q19.3(E) Q31.3
NetQ20_3: Q20.3(E) Q31.4
NetQ21_3: Q21.3(E) Q31.5
NetQ22_3: Q22.3(E) Q31.6
NetQ23_3: Q23.3(E) Q31.7
NetQ24_3: Q24.3(E) Q32.1
NetQ25_3: Q25.3(E) Q32.2
NetQ26_3: Q26.3(E) Q32.3
NetQ27_3: Q27.3(E) Q32.4
NetQ28_3: Q28.3(E) Q32.5
NetQ29_3: Q29.3(E) Q32.6
NetQ30_3: Q30.3(E) Q32.7

Not connected (* = marked no-connect by the designer): Q15 9; Q16 9; Q31 9; Q32 9

### Library data of the parts
1-14 29-42 = CL10A106MQ8NNNC: No Description Available; Mfr_Name: Samsung; Copyright: Copyright (C) 2022 Ultra Librarian. All rights reserved.; Manufacturer_Part_Number: CL10A106MQ8NNNC; Digi-Key_Part_Number_1: 1276-1119-2-ND; Digi-Key_Part_Number_2: 1276-1119-1-ND; Digi-Key_Part_Number_3: 1276-1119-6-ND; RefDes: RefDes; Type: DEV
15-28 43-56 = RMCF1206FT330R: No Description Available; Mfr_Name: Stackpole International; Copyright: Copyright (C) 2022 Ultra Librarian. All rights reserved.; Manufacturer_Part_Number: RMCF1206FT330R; Digi-Key_Part_Number_1: RMCF1206FT330RCT-ND; Digi-Key_Part_Number_2: RMCF1206FT330RDKR-ND; Digi-Key_Part_Number_3: RMCF1206FT330RTR-ND; RefDes: RefDes; Type: DEV
CR1-CR28 = 1N4007-G: No Description Available; Mfr_Name: Comchip; Type: DEV; Copyright: Copyright (C) 2022 Ultra Librarian. All rights reserved.; Manufacturer_Part_Number: 1N4007-G; Digi-Key_Part_Number_1: 641-1312-1-ND; Digi-Key_Part_Number_2: 641-1312-3-ND; RefDes: RefDes
Q1-Q14 Q17-Q30 = CMP-2000-06281-2: OPTOISOLATOR 5KV TRANSISTOR 4SMD; Manufacturer: ON Semiconductor; Collector Emitter Voltage: 70V; Forward Voltage: 1.2V; Isolation Voltage: 5000Vrms; Reverse Voltage: 6V; Forward Current: 50mA; Max Junction Temp: +125°C; Power Dissipation: 70mW; Standoff Height: 0.35mm; Min Current Transfer Ratio: 300%; Max Current Transfer Ratio: 600%; Lead Free: Yes; ComponentLink2URL: https://www.onsemi.cn/PowerSolutions/document/FOD814-D.PDF; RoHS: TRUE; Temperature Range Low: -55°C; Height: 3.85mm; Automotive: No; Octopart: https://octopart.com/fod817dsd-on+semiconductor-84327554; Device Class L2: Optocouplers; Emiiter Collector Voltage: 6V; Category: Trans; Device Class L1: Optoelectronics; ComponentLink2Description: Datasheet; Package: 709AH; Temperature Range High: +110°C; Temperature: -55°C to +110°C; Digikey Description: OPTOISOLATOR 5KV TRANSISTOR 4SMD; Device Class L3: unset; Mouser Description: OPTOISOLATOR 5KV TRANSISTOR 4SMD; Manufacturer Part Number: FOD817DSD; Footprint Url: https://www.onsemi.com/pub/Collateral/709AH.PDF
Q15 Q16 Q31 Q32 = MC1413BDR2G: No Description Available; Mfr_Name: onsemi; Type: DEV; Copyright: Copyright (C) 2022 Ultra Librarian. All rights reserved.; Manufacturer_Part_Number: MC1413BDR2G; Digi-Key_Part_Number_1: MC1413BDR2GOSCT-ND; Digi-Key_Part_Number_2: MC1413BDR2GOSDKR-ND; Digi-Key_Part_Number_3: MC1413BDR2GOSTR-ND; RefDes: RefDes

## Sheet Relay I2C to GPIO.SchDoc
size D; SheetNumber: 3; SheetTotal: 3; SPICEModelCacheMARDRAIJ: <root> / <DocumentId>MARDRAIJ</DocumentId> / <CacheFrame Number="0"> / <Model Name="cap" Kind="MDL"> / <Text>*Default semiconductor capacitor / .MODEL CAP C()</Text> / </Model> / </CacheFrame> / </root>
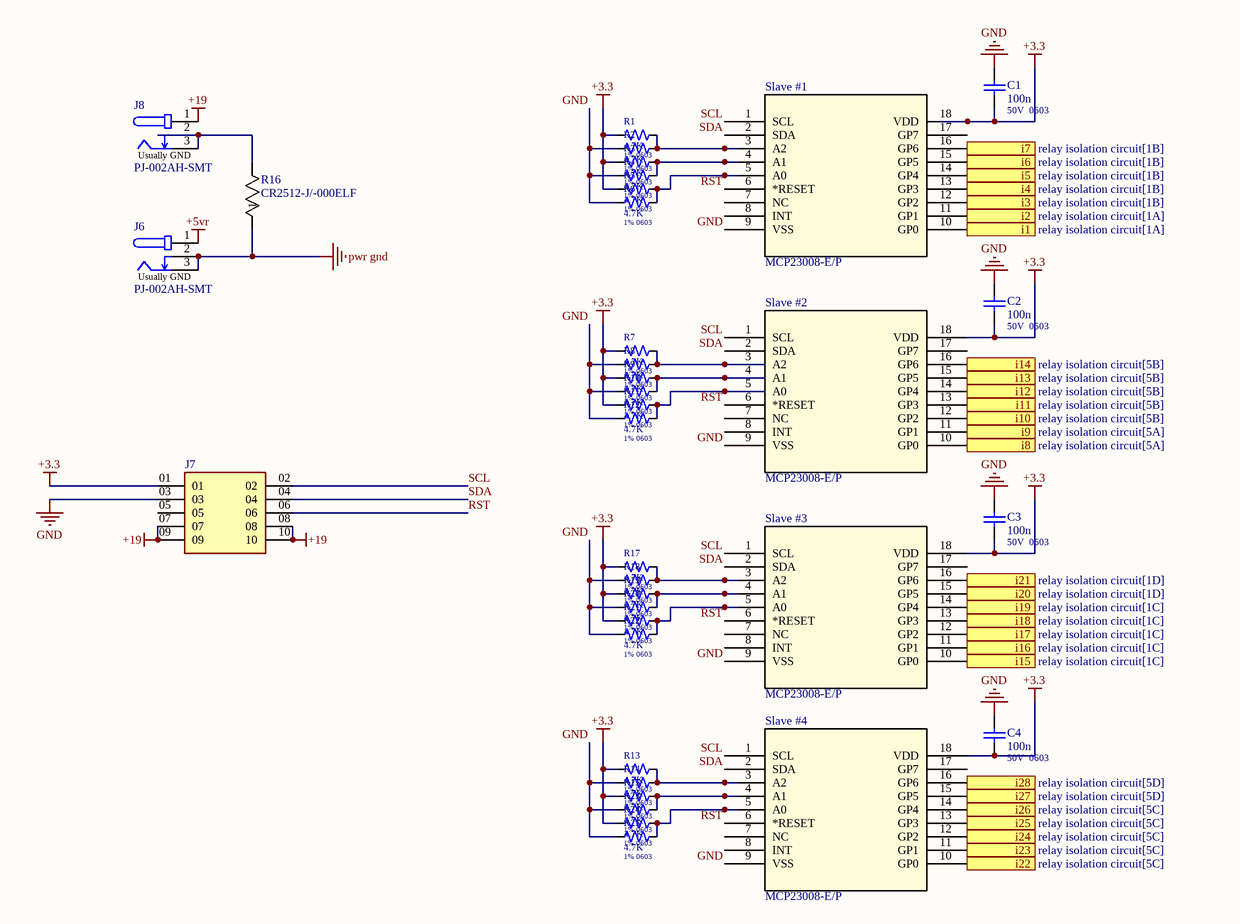
[diagram p6: Relay I2C to GPIO.SchDoc]

### Parts
C1  value 100n  TEXT: 50V  0603  [CAPC1608N_NP]  (hidden comment: GCM188R71H104KA57D)
C2  value 100n  TEXT: 50V  0603  [CAPC1608N_NP]  (hidden comment: GCM188R71H104KA57D)
C3  value 100n  TEXT: 50V  0603  [CAPC1608N_NP]  (hidden comment: GCM188R71H104KA57D)
C4  value 100n  TEXT: 50V  0603  [CAPC1608N_NP]  (hidden comment: GCM188R71H104KA57D)
J6  PJ-002AH-SMT  [PJ-002AH-SMT]
J7  (no value)  [10pinheader]
J8  PJ-002AH-SMT  [PJ-002AH-SMT]
R1  value 4.7K  text: 1% 0603  [RESC1608N]  (hidden comment: 0603_k4.7K)
R2  value 4.7K  text: 1% 0603  [RESC1608N]  (hidden comment: 0603_k4.7K)
R3  value 4.7K  text: 1% 0603  [RESC1608N]  (hidden comment: 0603_k4.7K)
R4  value 4.7K  text: 1% 0603  [RESC1608N]  (hidden comment: 0603_k4.7K)
R5  value 4.7K  text: 1% 0603  [RESC1608N]  (hidden comment: 0603_k4.7K)
R6  value 4.7K  text: 1% 0603  [RESC1608N]  (hidden comment: 0603_k4.7K)
R7  value 4.7K  text: 1% 0603  [RESC1608N]  (hidden comment: 0603_k4.7K)
R8  value 4.7K  text: 1% 0603  [RESC1608N]  (hidden comment: 0603_k4.7K)
R9  value 4.7K  text: 1% 0603  [RESC1608N]  (hidden comment: 0603_k4.7K)
R10  value 4.7K  text: 1% 0603  [RESC1608N]  (hidden comment: 0603_k4.7K)
R11  value 4.7K  text: 1% 0603  [RESC1608N]  (hidden comment: 0603_k4.7K)
R12  value 4.7K  text: 1% 0603  [RESC1608N]  (hidden comment: 0603_k4.7K)
R13  value 4.7K  text: 1% 0603  [RESC1608N]  (hidden comment: 0603_k4.7K)
R14  value 4.7K  text: 1% 0603  [RESC1608N]  (hidden comment: 0603_k4.7K)
R15  value 4.7K  text: 1% 0603  [RESC1608N]  (hidden comment: 0603_k4.7K)
R16  CR2512-J/-000ELF  [BO_CR2512]
R17  value 4.7K  text: 1% 0603  [RESC1608N]  (hidden comment: 0603_k4.7K)
R18  value 4.7K  text: 1% 0603  [RESC1608N]  (hidden comment: 0603_k4.7K)
R19  value 4.7K  text: 1% 0603  [RESC1608N]  (hidden comment: 0603_k4.7K)
R20  value 4.7K  text: 1% 0603  [RESC1608N]  (hidden comment: 0603_k4.7K)
R21  value 4.7K  text: 1% 0603  [RESC1608N]  (hidden comment: 0603_k4.7K)
R22  value 4.7K  text: 1% 0603  [RESC1608N]  (hidden comment: 0603_k4.7K)
R23  value 4.7K  text: 1% 0603  [RESC1608N]  (hidden comment: 0603_k4.7K)
R24  value 4.7K  text: 1% 0603  [RESC1608N]  (hidden comment: 0603_k4.7K)
R25  value 4.7K  text: 1% 0603  [RESC1608N]  (hidden comment: 0603_k4.7K)
Slave_#1  MCP23008-E/P  [PDIP18_300MC_MCH]
Slave_#2  MCP23008-E/P  [PDIP18_300MC_MCH]
Slave_#3  MCP23008-E/P  [PDIP18_300MC_MCH]
Slave_#4  MCP23008-E/P  [PDIP18_300MC_MCH]

### Ports
i1 (see relay isolation circuit[1A]), i2 (see relay isolation circuit[1A]), i3 (see relay isolation circuit[1B]), i4 (see relay isolation circuit[1B]), i5 (see relay isolation circuit[1B]), i6 (see relay isolation circuit[1B]), i7 (see relay isolation circuit[1B]), i8 (see relay isolation circuit[5A]), i9 (see relay isolation circuit[5A]), i10 (see relay isolation circuit[5B]), i11 (see relay isolation circuit[5B]), i12 (see relay isolation circuit[5B]), i13 (see relay isolation circuit[5B]), i14 (see relay isolation circuit[5B]), i15 (see relay isolation circuit[1C]), i16 (see relay isolation circuit[1C]), i17 (see relay isolation circuit[1C]), i18 (see relay isolation circuit[1C]), i19 (see relay isolation circuit[1C]), i20 (see relay isolation circuit[1D]), i21 (see relay isolation circuit[1D]), i22 (see relay isolation circuit[5C]), i23 (see relay isolation circuit[5C]), i24 (see relay isolation circuit[5C]), i25 (see relay isolation circuit[5C]), i26 (see relay isolation circuit[5C]), i27 (see relay isolation circuit[5D]), i28 (see relay isolation circuit[5D])

### Nets
+3.3: C1.1 C2.1 C3.1 C4.1 J7.01 R1.1 R3.1 R5.1 R7.1 R9.1 R11.1 R13.1 R15.1 R17.1 R19.1 R21.1 R24.1 Slave_#1.18(VDD) Slave_#2.18(VDD) Slave_#3.18(VDD) Slave_#4.18(VDD)
+5vr: J6.1
+19: J7.07 J7.08 J7.09 J7.10 J8.1
GND: C1.2 C2.2 C3.2 C4.2 J7.03 R2.1 R4.1 R6.1 R8.1 R10.1 R12.1 R14.1 R18.1 R20.1 R22.1 R23.1 R25.1 Slave_#1.9(VSS) Slave_#2.9(VSS) Slave_#3.9(VSS) Slave_#4.9(VSS)
pwr gnd: J6.2 J6.3 R16.1
RST: J7.06 Slave_#1.6(*RESET) Slave_#2.6(*RESET) Slave_#3.6(*RESET) Slave_#4.6(*RESET)
SCL: J7.02 Slave_#1.1(SCL) Slave_#2.1(SCL) Slave_#3.1(SCL) Slave_#4.1(SCL)
SDA: J7.04 Slave_#1.2(SDA) Slave_#2.2(SDA) Slave_#3.2(SDA) Slave_#4.2(SDA)
Net1_2: Slave_#3.11(GP1) ; port i16
Net2_2: Slave_#3.12(GP2) ; port i17
Net3_2: Slave_#3.13(GP3) ; port i18
Net4_2: Slave_#3.14(GP4) ; port i19
Net5_2: Slave_#3.15(GP5) ; port i20
Net6_2: Slave_#3.16(GP6) ; port i21
Net7_2: Slave_#1.11(GP1) ; port i2
Net8_2: Slave_#1.12(GP2) ; port i3
Net9_2: Slave_#1.13(GP3) ; port i4
Net10_2: Slave_#1.14(GP4) ; port i5
Net11_2: Slave_#1.15(GP5) ; port i6
Net12_2: Slave_#1.16(GP6) ; port i7
Net13_2: Slave_#3.10(GP0) ; port i15
Net14_2: Slave_#1.10(GP0) ; port i1
Net29_2: Slave_#2.10(GP0) ; port i8
Net30_2: Slave_#2.11(GP1) ; port i9
Net31_2: Slave_#2.12(GP2) ; port i10
Net32_2: Slave_#2.13(GP3) ; port i11
Net33_2: Slave_#2.14(GP4) ; port i12
Net34_2: Slave_#2.15(GP5) ; port i13
Net35_2: Slave_#2.16(GP6) ; port i14
Net36_2: Slave_#4.12(GP2) ; port i24
Net37_2: Slave_#4.13(GP3) ; port i25
Net38_2: Slave_#4.14(GP4) ; port i26
Net39_2: Slave_#4.15(GP5) ; port i27
Net40_2: Slave_#4.16(GP6) ; port i28
Net41_2: Slave_#4.10(GP0) ; port i22
Net42_2: Slave_#4.11(GP1) ; port i23
NetJ8_2: J8.2 J8.3 R16.2
NetR1_2: R1.2 R2.2 Slave_#1.3(A2)
NetR3_2: R3.2 R4.2 Slave_#1.4(A1)
NetR5_2: R5.2 R6.2 Slave_#1.5(A0)
NetR7_2: R7.2 R8.2 Slave_#2.3(A2)
NetR9_2: R9.2 R10.2 Slave_#2.4(A1)
NetR11_2: R11.2 R12.2 Slave_#2.5(A0)
NetR13_2: R13.2 R14.2 Slave_#4.3(A2)
NetR15_2: R15.2 R23.2 Slave_#4.4(A1)
NetR17_2: R17.2 R18.2 Slave_#3.3(A2)
NetR19_2: R19.2 R20.2 Slave_#3.4(A1)
NetR21_2: R21.2 R22.2 Slave_#3.5(A0)
NetR24_2: R24.2 R25.2 Slave_#4.5(A0)

Not connected (* = marked no-connect by the designer): J7 05; Slave_#1 7(NC) 8(INT) 17(GP7); Slave_#2 7(NC) 8(INT) 17(GP7); Slave_#3 7(NC) 8(INT) 17(GP7); Slave_#4 7(NC) 8(INT) 17(GP7)

### Notes on the sheet
- (in symbol PJ-002AH-SMT) Usually GND

### Library data of the parts
C1-C4 = CAP_n100n_0603_50V: Cap 100nF, 50V, X7R, Ceramic, 1608(0603); Manufacturer: Murata Electronics North America; Value_Sort: 100e-9; TOLERANCE: 10%; VOLTAGE: 50; LatestRevisionAuthor: David Class; Supplier 1: Digi-Key; Supplier Part Number 1: 490-4779-1-ND; Manufacturer Part Number: GCM188R71H104KA57D; HelpURL: http://search.digikey.com/scripts/DkSearch/dksus.dll?Detail&name=490-4779-1-ND; ComponentLink1URL: http://search.murata.co.jp/Ceramy/image/img/PDF/ENG/GCM188R71H104KA57.pdf; ComponentLink1Description: Datasheet; DIELECTRIC: X7R; PackageReference: 1608[0603]
J6 J8 = PJ-002AH-SMT: 2.1mm x 5.5mm Barrel Jack 5A@24V 30mOhm Contact Resistance; Manufacturer: CUI Inc; LatestRevisionComment: rev2 - decresed hole size by .1mm check footprint; LatestRevisionAuthor: David Class; LatestRevisionDate: 24-Nov-09; HelpURL: http://search.digikey.com/scripts/DkSearch/dksus.dll?Detail&name=CP-002AHPJCT-ND; Manufacturer Part Number: PJ-002AH-SMT; ComponentLink1URL: http://www.cui.com/pdffiles/PJ-002AH-SMT.pdf; ComponentLink1Description: Datasheet; ComponentLink2URL: http://www.cui.com/adtemplate.asp?invky=501659; ComponentLink2Description: Manufacturer Website; Supplier 1: Digi-Key; Supplier Part Number 1: CP-002AHPJCT-ND; Mounting Type: SM
J7 = TMMH-105-01-F-D: Package: None; Price: None; Value: *; MP: TMMH-105-01-F-D; Availability: Unavailable
R1-R15 R17-R25 = 0603_k4.7K: RES 4.7K OHM 1/10W 1% 0603 SMD; Manufacturer: Vishay Dale; Manufacturer Part Number: CRCW06034K70FKEA; Value_Sort: 4700; Power (Watts): 0.1W, 1/10W; Temperature Coefficient: ±100ppm/°C; Supplier 1: Digi-Key; RoHS: RoHS Compliant; Category: Resistors; Stock 1: 56790; Pricing 1: 10=0.081, 50=0.0436, 200=0.0251, 1000=0.01711 (USD); Packaging: Cut Tape (CT); Resistance (Ohms): 4.7k; Tolerance: ±1%; Composition: Thick Film; Features: Automotive AEC-Q200 Qualified; Package / Case: 0603 (1608 Metric); Supplier Device Package: 0603 (1608 Metric); Size / Dimension: 0.061" L x 0.033" W (1.55mm x 0.85mm); Height: 0.020" (0.50mm); Number of Terminations: 2; ComponentLink1URL: http://www.vishay.com/doc?20035; ComponentLink1Description: http://www.vishay.com/doc?20035; Supplier Part Number 1: 541-4.70KHCT-ND
R16 = CR2512-J/-000ELF: No Description Available; Mfr_Name: Bourns Electronics; Copyright: Copyright (C) 2022 Ultra Librarian. All rights reserved.; Manufacturer_Part_Number: CR2512-J/-000ELF; Digi-Key_Part_Number_1: CR2512-J/-000ELFCT-ND; Digi-Key_Part_Number_2: CR2512-J/-000ELFDKR-ND; Digi-Key_Part_Number_3: CR2512-J/-000ELFTR-ND; RefDes: RefDes; Type: DEV
Slave_#1-Slave_#4 = MCP23008-E/P: No Description Available; Mfr_Name: Microchip; Copyright: Copyright (C) 2022 Ultra Librarian. All rights reserved.; Manufacturer_Part_Number: MCP23008-E/P; Digi-Key_Part_Number_1: MCP23008-E/P-ND; RefDes: RefDes; Type: DEV

## Nets that join several sheets
+5vr: relay isolation circuit (28 pins), Relay I2C to GPIO (J6.1)
+19: multiplexor circuit (48 pins), relay isolation circuit (28 pins), Relay I2C to GPIO (5 pins)
GND: relay isolation circuit (56 pins), Relay I2C to GPIO (21 pins)
pwr gnd: relay isolation circuit (Q15.8 Q16.8 Q31.8 Q32.8), Relay I2C to GPIO (J6.2 J6.3 R16.1)
Net1_2: relay isolation circuit (1.2 Q2.1), Relay I2C to GPIO (Slave_#3.11)
Net2_2: relay isolation circuit (2.2 Q3.1), Relay I2C to GPIO (Slave_#3.12)
Net3_2: relay isolation circuit (3.2 Q4.1), Relay I2C to GPIO (Slave_#3.13)
Net4_2: relay isolation circuit (4.2 Q5.1), Relay I2C to GPIO (Slave_#3.14)
Net5_2: relay isolation circuit (5.2 Q6.1), Relay I2C to GPIO (Slave_#3.15)
Net6_2: relay isolation circuit (6.2 Q7.1), Relay I2C to GPIO (Slave_#3.16)
Net7_2: relay isolation circuit (7.2 Q9.1), Relay I2C to GPIO (Slave_#1.11)
Net8_2: relay isolation circuit (8.2 Q10.1), Relay I2C to GPIO (Slave_#1.12)
Net9_2: relay isolation circuit (9.2 Q11.1), Relay I2C to GPIO (Slave_#1.13)
Net10_2: relay isolation circuit (10.2 Q12.1), Relay I2C to GPIO (Slave_#1.14)
Net11_2: relay isolation circuit (11.2 Q13.1), Relay I2C to GPIO (Slave_#1.15)
Net12_2: relay isolation circuit (12.2 Q14.1), Relay I2C to GPIO (Slave_#1.16)
Net13_2: relay isolation circuit (13.2 Q1.1), Relay I2C to GPIO (Slave_#3.10)
Net14_2: relay isolation circuit (14.2 Q8.1), Relay I2C to GPIO (Slave_#1.10)
Net29_2: relay isolation circuit (29.2 Q17.1), Relay I2C to GPIO (Slave_#2.10)
Net30_2: relay isolation circuit (30.2 Q18.1), Relay I2C to GPIO (Slave_#2.11)
Net31_2: relay isolation circuit (31.2 Q19.1), Relay I2C to GPIO (Slave_#2.12)
Net32_2: relay isolation circuit (32.2 Q20.1), Relay I2C to GPIO (Slave_#2.13)
Net33_2: relay isolation circuit (33.2 Q21.1), Relay I2C to GPIO (Slave_#2.14)
Net34_2: relay isolation circuit (34.2 Q22.1), Relay I2C to GPIO (Slave_#2.15)
Net35_2: relay isolation circuit (35.2 Q23.1), Relay I2C to GPIO (Slave_#2.16)
Net36_2: relay isolation circuit (36.2 Q26.1), Relay I2C to GPIO (Slave_#4.12)
Net37_2: relay isolation circuit (37.2 Q27.1), Relay I2C to GPIO (Slave_#4.13)
Net38_2: relay isolation circuit (38.2 Q28.1), Relay I2C to GPIO (Slave_#4.14)
Net39_2: relay isolation circuit (39.2 Q29.1), Relay I2C to GPIO (Slave_#4.15)
Net40_2: relay isolation circuit (40.2 Q30.1), Relay I2C to GPIO (Slave_#4.16)
Net41_2: relay isolation circuit (41.2 Q24.1), Relay I2C to GPIO (Slave_#4.10)
Net42_2: relay isolation circuit (42.2 Q25.1), Relay I2C to GPIO (Slave_#4.11)
NetCR1_2: multiplexor circuit (K1.1_1 K1.1_2), relay isolation circuit (CR1.2 Q16.16)
NetCR2_2: multiplexor circuit (K2.1_1 K2.1_2), relay isolation circuit (CR2.2 Q16.15)
NetCR3_2: multiplexor circuit (K3.1_1 K3.1_2), relay isolation circuit (CR3.2 Q16.14)
NetCR4_2: multiplexor circuit (K4.1_1 K4.1_2), relay isolation circuit (CR4.2 Q16.13)
NetCR5_2: multiplexor circuit (K5.1 K5.2), relay isolation circuit (CR5.2 Q16.12)
NetCR6_2: multiplexor circuit (K6.1 K6.2), relay isolation circuit (CR6.2 Q16.11)
NetCR7_2: multiplexor circuit (K7.1 K7.2), relay isolation circuit (CR7.2 Q16.10)
NetCR8_2: multiplexor circuit (K8.1 K8.2), relay isolation circuit (CR8.2 Q31.16)
NetCR9_2: multiplexor circuit (K9.1 K9.2), relay isolation circuit (CR9.2 Q31.15)
NetCR10_2: multiplexor circuit (K10.1 K10.2), relay isolation circuit (CR10.2 Q31.14)
NetCR11_2: multiplexor circuit (K11.1 K11.2), relay isolation circuit (CR11.2 Q31.13)
NetCR12_2: multiplexor circuit (K12.1 K12.2), relay isolation circuit (CR12.2 Q31.12)
NetCR13_2: multiplexor circuit (K13.1 K13.2), relay isolation circuit (CR13.2 Q31.11)
NetCR14_2: multiplexor circuit (K14.1 K14.2), relay isolation circuit (CR14.2 Q31.10)
NetCR15_2: multiplexor circuit (K15.1 K15.2), relay isolation circuit (CR15.2 Q15.16)
NetCR16_2: multiplexor circuit (K16.1 K16.2), relay isolation circuit (CR16.2 Q15.15)
NetCR17_2: multiplexor circuit (K19.1 K19.2), relay isolation circuit (CR17.2 Q15.14)
NetCR18_2: multiplexor circuit (K22.1 K22.2), relay isolation circuit (CR18.2 Q15.13)
NetCR19_2: multiplexor circuit (K17.1 K17.2), relay isolation circuit (CR19.2 Q15.12)
NetCR20_2: multiplexor circuit (K23.1 K23.2), relay isolation circuit (CR20.2 Q15.11)
NetCR21_2: multiplexor circuit (K20.1 K20.2), relay isolation circuit (CR21.2 Q15.10)
NetCR22_2: multiplexor circuit (K24.1 K24.2), relay isolation circuit (CR22.2 Q32.16)
NetCR23_2: multiplexor circuit (K18.1 K18.2), relay isolation circuit (CR23.2 Q32.15)
NetCR24_2: multiplexor circuit (K21.1 K21.2), relay isolation circuit (CR24.2 Q32.14)